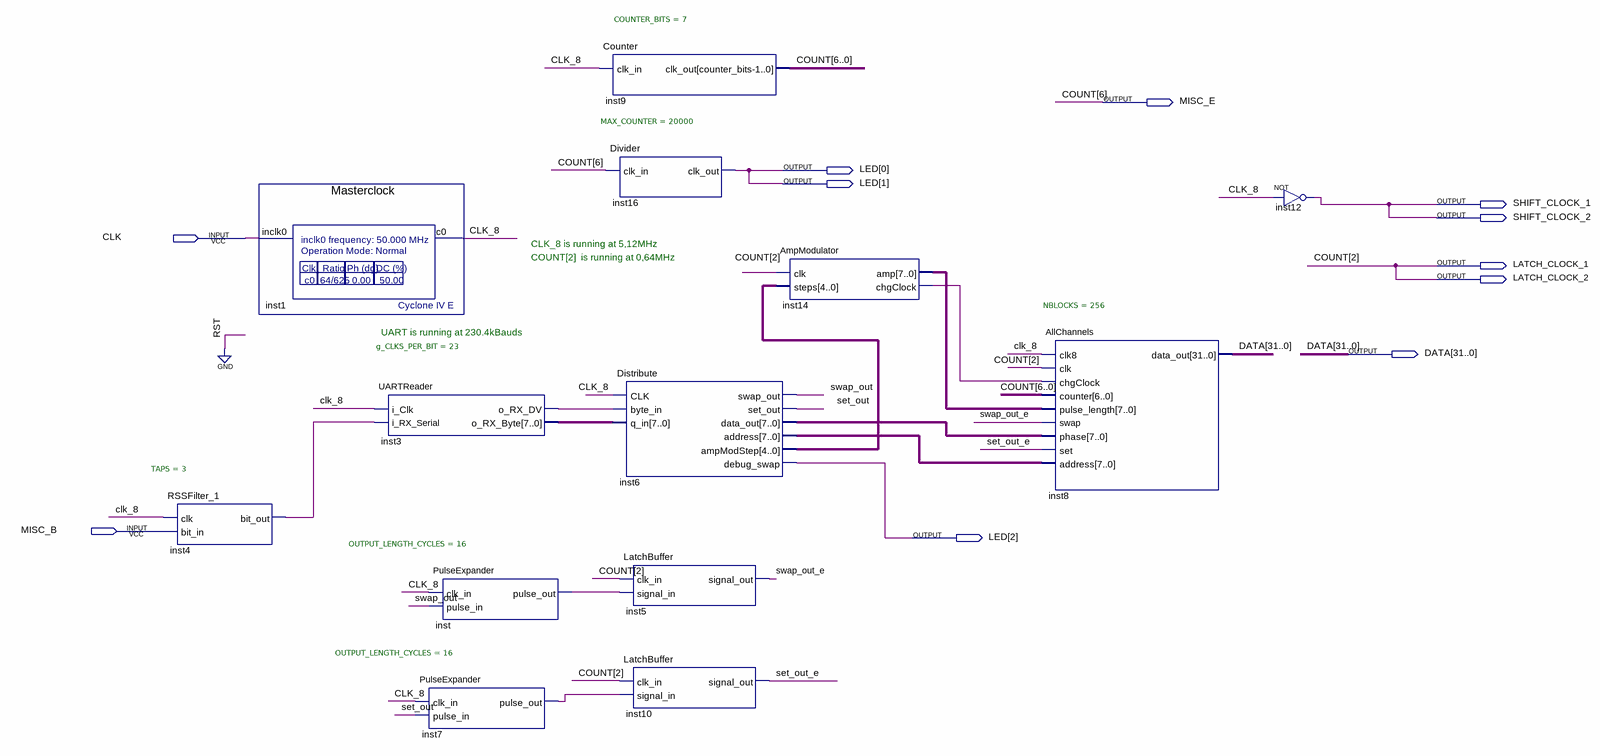
[diagram p0: schematic sheet]
// Quartus schematic QuadrupleBuffer.bdf as structural Verilog: 13 symbols, 11 pins
module QuadrupleBuffer (
  input  CLK,
  input  MISC_B,
  output MISC_E,
  output [2:0] LED,
  output SHIFT_CLOCK_1,
  output SHIFT_CLOCK_2,
  output LATCH_CLOCK_1,
  output LATCH_CLOCK_2,
  output [31:0] DATA
);

  wire CLK_8, inst3_o_rx_dv, inst4_bit_out, inst7_pulse_out, inst14_chgclock, inst_pulse_out, set_out,
       set_out_e, swap_out, swap_out_e;
  wire [4:0] inst6_ampmodstep;
  wire [5:0] COUNT;
  wire [7:0] inst3_o_rx_byte, inst6_address, inst6_data_out, inst14_amp;

  RSSFilter_1 #(.TAPS(3)) inst4 (.clk(CLK_8), .bit_in(MISC_B), .bit_out(inst4_bit_out));
  Masterclock inst1 (.inclk0(CLK), .c0(CLK_8));
  UARTReader #(.g_CLKS_PER_BIT(23)) inst3 (
    .i_Clk(CLK_8), .i_RX_Serial(inst4_bit_out), .o_RX_DV(inst3_o_rx_dv), .o_RX_Byte(inst3_o_rx_byte));
  PulseExpander #(.OUTPUT_LENGTH_CYCLES(16)) inst7 (.clk_in(CLK_8), .pulse_in(set_out), .pulse_out(inst7_pulse_out));
  PulseExpander #(.OUTPUT_LENGTH_CYCLES(16)) inst (.clk_in(CLK_8), .pulse_in(swap_out), .pulse_out(inst_pulse_out));
  Counter #(.COUNTER_BITS(7)) inst9 (.clk_in(CLK_8), .clk_out({MISC_E, COUNT[5:3], LATCH_CLOCK_1, COUNT[1:0]}));
  Divider #(.MAX_COUNTER(20000)) inst16 (.clk_in(MISC_E), .clk_out(LED[1]));
  Distribute inst6 (
    .CLK(CLK_8), .byte_in(inst3_o_rx_dv), .q_in(inst3_o_rx_byte), .swap_out(swap_out), .set_out(set_out),
    .data_out(inst6_data_out), .address(inst6_address), .ampModStep(inst6_ampmodstep), .debug_swap(LED[2]));
  LatchBuffer inst5 (.clk_in(LATCH_CLOCK_1), .signal_in(inst_pulse_out), .signal_out(swap_out_e));
  LatchBuffer inst10 (.clk_in(LATCH_CLOCK_1), .signal_in(inst7_pulse_out), .signal_out(set_out_e));
  AmpModulator inst14 (.clk(LATCH_CLOCK_1), .steps(inst6_ampmodstep), .amp(inst14_amp), .chgClock(inst14_chgclock));
  AllChannels #(.NBLOCKS(256)) inst8 (
    .clk8(CLK_8), .clk(LATCH_CLOCK_1), .chgClock(inst14_chgclock),
    .counter({MISC_E, COUNT[5:3], LATCH_CLOCK_1, COUNT[1:0]}), .pulse_length(inst14_amp), .swap(swap_out_e),
    .phase(inst6_data_out), .set(set_out_e), .address(inst6_address), .data_out(DATA));
  not inst12 (SHIFT_CLOCK_1, CLK_8);

  assign LATCH_CLOCK_2 = LATCH_CLOCK_1;
  assign LED[0] = LED[1];
  assign SHIFT_CLOCK_2 = SHIFT_CLOCK_1;

  // Other names for the same wires on the sheet: COUNT (some bits) = {MISC_E, LATCH_CLOCK_1}

  // Notes on the sheet:
  //   CLK_8 is running at 5,12MHz
  //   COUNT[2]  is running at 0,64MHz 
  //   UART is running at 230.4kBauds
endmodule
